# EAGLE design busfahrer (EAGLE 6.1)
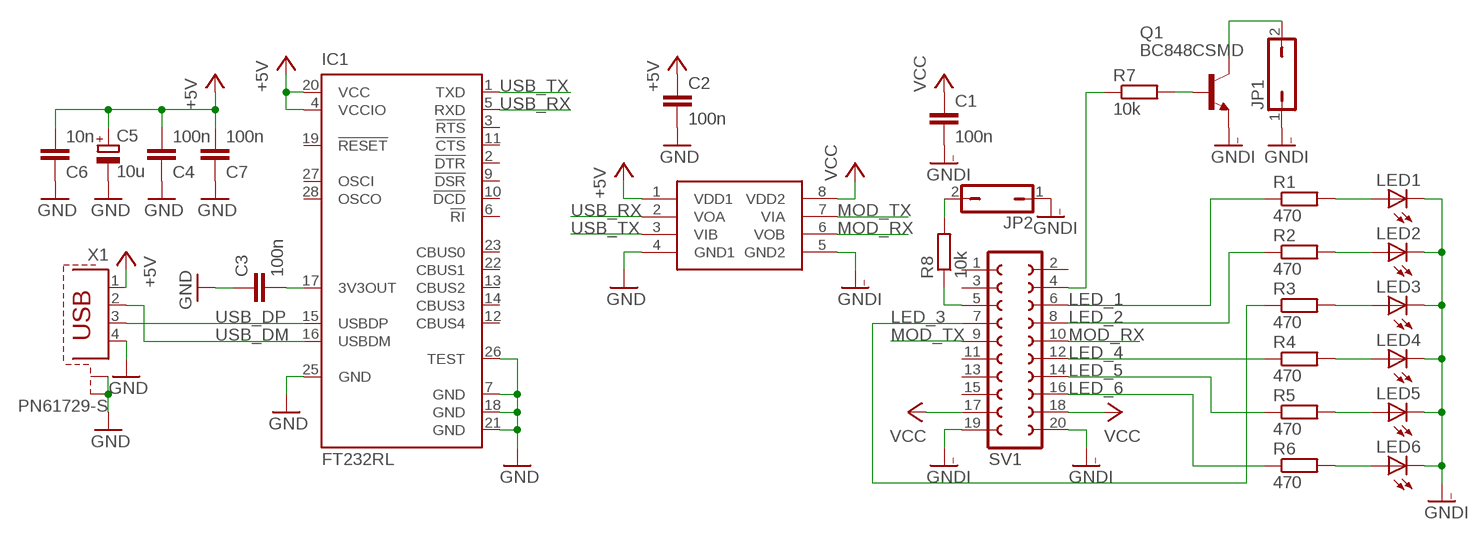
[diagram p0: schematic, sheet 1]

## Parts
C1  100n  C-EUC0805  [C0805]
C2  100n  C-EUC0805  [C0805]
C3  100n  C-EUC0805  [C0805]
C4  100n  C-EUC0805  [C0805]
C5  10u  CPOL-EUE1.8-4  [E1,8-4]
C6  10n  C-EUC0805  [C0805]
C7  100n  C-EUC0805  [C0805]
IC1  FT232RL  [SSOP28]
JP1  JP1Q  [JP1]
JP2  JP1Q  [JP1]
LED1  LEDCHIPLED_0805  [CHIPLED_0805]
LED2  LEDCHIPLED_0805  [CHIPLED_0805]
LED3  LEDCHIPLED_0805  [CHIPLED_0805]
LED4  LEDCHIPLED_0805  [CHIPLED_0805]
LED5  LEDCHIPLED_0805  [CHIPLED_0805]
LED6  LEDCHIPLED_0805  [CHIPLED_0805]
Q1  BC848CSMD  [SOT23]
R1  470  R-EU_R0805  [R0805]
R2  470  R-EU_R0805  [R0805]
R3  470  R-EU_R0805  [R0805]
R4  470  R-EU_R0805  [R0805]
R5  470  R-EU_R0805  [R0805]
R6  470  R-EU_R0805  [R0805]
R7  10k  R-EU_R0805  [R0805]
R8  10k  R-EU_R0805  [R0805]
SV1  FE10-2  [FE10-2]
U$1  ADUM3211  [SO8]
X1  PN61729-S  [PN61729-S]

## Nets
3V3: C3.2 IC1.17(3V3OUT)
!PS_ON: JP1.2 Q1.3(C)
+5V: C2.1 C4.2 C5.+ C6.2 C7.2 IC1.4(VCCIO) IC1.20(VCC) U$1.1(VDD1) X1.1
GND: C2.2 C3.1 C4.1 C5.- C6.1 C7.1 IC1.7(GND) IC1.18(GND) IC1.21(GND) IC1.25(GND) IC1.26(TEST) U$1.4(GND1) X1.4 X1.S1 X1.S2
GNDI: C1.2 JP1.1 JP2.1 LED1.C LED2.C LED3.C LED4.C LED5.C LED6.C Q1.2(E) SV1.19 SV1.20 U$1.5(GND2)
LED_1: R1.1 SV1.6
LED_2: R2.1 SV1.8
LED_3: R3.1 SV1.7
LED_4: R4.1 SV1.12
LED_5: R5.1 SV1.14
LED_6: R6.1 SV1.16
MOD_RX: SV1.10 U$1.6(VOB)
MOD_TX: SV1.9 U$1.7(VIA)
N$1: Q1.1(B) R7.2
N$2: R7.1 SV1.4
N$4: R8.1 SV1.5
N$7: LED1.A R1.2
N$8: LED2.A R2.2
N$9: LED3.A R3.2
N$10: LED4.A R4.2
N$11: LED5.A R5.2
N$12: LED6.A R6.2
PWR_OK: JP2.2 R8.2
USB_DM: IC1.16(USBDM) X1.2
USB_DP: IC1.15(USBDP) X1.3
USB_RX: IC1.5(RXD) U$1.2(VOA)
USB_TX: IC1.1(TXD) U$1.3(VIB)
VCC: C1.1 SV1.17 SV1.18 U$1.8(VDD2)
Unconnected: IC1.2(!DTR) IC1.3(!RTS) IC1.6(!RI) IC1.9(!DSR) IC1.10(!DCD) IC1.11(!CTS) IC1.12(CBUS4) IC1.13(CBUS2) IC1.14(CBUS3) IC1.19(!RESET) IC1.22(CBUS1) IC1.23(CBUS0) IC1.27(OSCI) IC1.28(OSCO) SV1.1 SV1.2 SV1.3 SV1.11 SV1.13 SV1.15

## Library data of the parts
C1-C4 C6 C7 = rcl:C-EU: CAPACITOR, European symbol
C5 = rcl:CPOL-EU: POLARIZED CAPACITOR, European symbol
IC1 = ftdichip:FT232R: Source: http://www.ftdichip.com/Documents/DataSheets/DS_FT232R_v104.pdf; MPN: FT232RL; OC_FARNELL: 1146032; OC_NEWARK: 91K9918
JP1 JP2 = jumper:JP1Q: JUMPER
LED1-LED6 = led:LED: LED OSRAM: - CHIPLED LG R971, LG N971, LY N971, LG Q971, LY Q971, LO R971, LY R971 LH N974, LH R974 LS Q976, LO Q976, LY Q976 LO Q996 - Hyper CHIPLED LW Q18S LB Q993, LB Q99A, LB R99A - SideLED LS A670, LO A670, LY A670, LG A670, LP A670 LB A673, LV A673, LT A673, LW A673 LH A674 LY A675 LS A676, LA A676, LO A676, LY A676, LW A676 LS A679, LY A679, LG A679 - Hyper Micro SIDELED® LS Y876, LA Y876, LO Y876, LY Y876 LT Y87S - SmartLED LW L88C, LW L88S LB L89C, LB L89S, LG L890 LS L89K, LO L89K, LY L89K LS L896, LA L896, LO L896, LY L896 - TOPLED LS T670, LO T670, LY T670, LG T670, LP T670 LSG T670, LSP T670, LSY T670, LOP T670, LYG T670 LG T671, LOG T671, LSG T671 LB T673, LV T673, LT T673, LW T673 LH T674 LS T676, LA T676, LO T676, LY T676, LB T676, LH T676, LSB T676, LW T676 LB T67C, LV T67C, LT T67C, LS T67K, LO T67K, LY T67K, LW E67C LS E67B, LA E67B, LO E67B, LY E67B, LB E67C, LV E67C, LT E67C LW T67C LS T679, LY T679, LG T679 LS T770, LO T770, LY T770, LG T770, LP T770 LB T773, LV T773, LT T773, LW T773 LH T774 LS E675, LA E675, LY E675, LS T675 LS T776, LA T776, LO T776, LY T776, LB T776 LHGB T686 LT T68C, LB T68C - Hyper Mini TOPLED® LB M676 - Mini TOPLED Santana® LG M470 LS M47K, LO M47K, LY M47K Source: http://www.osram.convergy.de LUXEON: - LUMILED® LXK2-PW12-R00, LXK2-PW12-S00, LXK2-PW14-U00, LXK2-PW14-V00 LXK2-PM12-R00, LXK2-PM12-S00, LXK2-PM14-U00 LXK2-PE12-Q00, LXK2-PE12-R00, LXK2-PE12-S00, LXK2-PE14-T00, LXK2-PE14-U00 LXK2-PB12-K00, LXK2-PB12-L00, LXK2-PB12-M00, LXK2-PB14-N00, LXK2-PB14-P00, LXK2-PB14-Q00 LXK2-PR12-L00, LXK2-PR12-M00, LXK2-PR14-Q00, LXK2-PR14-R00 LXK2-PD12-Q00, LXK2-PD12-R00, LXK2-PD12-S00 LXK2-PH12-R00, LXK2-PH12-S00 LXK2-PL12-P00, LXK2-PL12-Q00, LXK2-PL12-R00 Source: www.luxeon.com KINGBRIGHT: KA-3528ASYC Source: www.kingbright.com
Q1 = transistor-npn:BC848*: NPN Transistor
R1-R8 = rcl:R-EU_: RESISTOR, European symbol
SV1 = con-lsta:FE10-2: FEMALE HEADER; OC_FARNELL: unknown; OC_NEWARK: unknown
U$1 = adum3211:ADUM3211
X1 = con-berg:PN61729-S: BERG USB connector; OC_FARNELL: unknown; OC_NEWARK: unknown

## Board
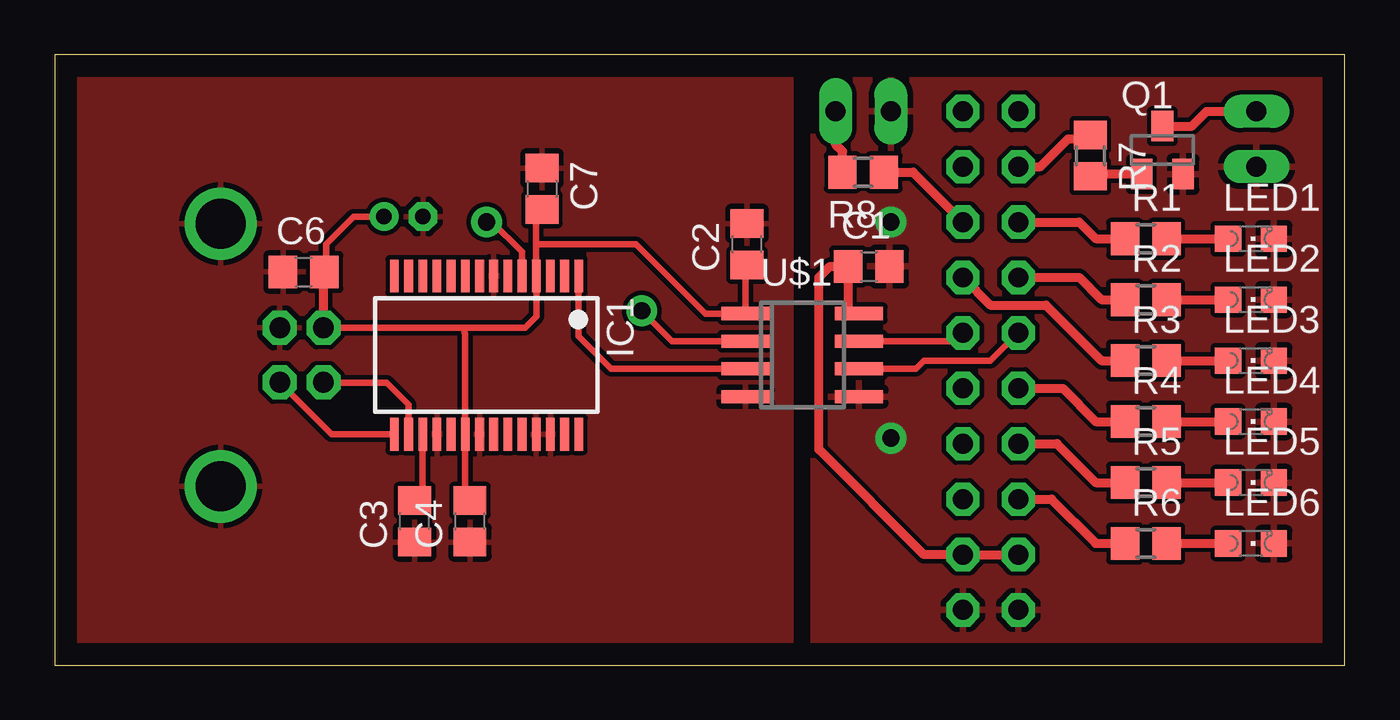
[diagram p1: board, top side]
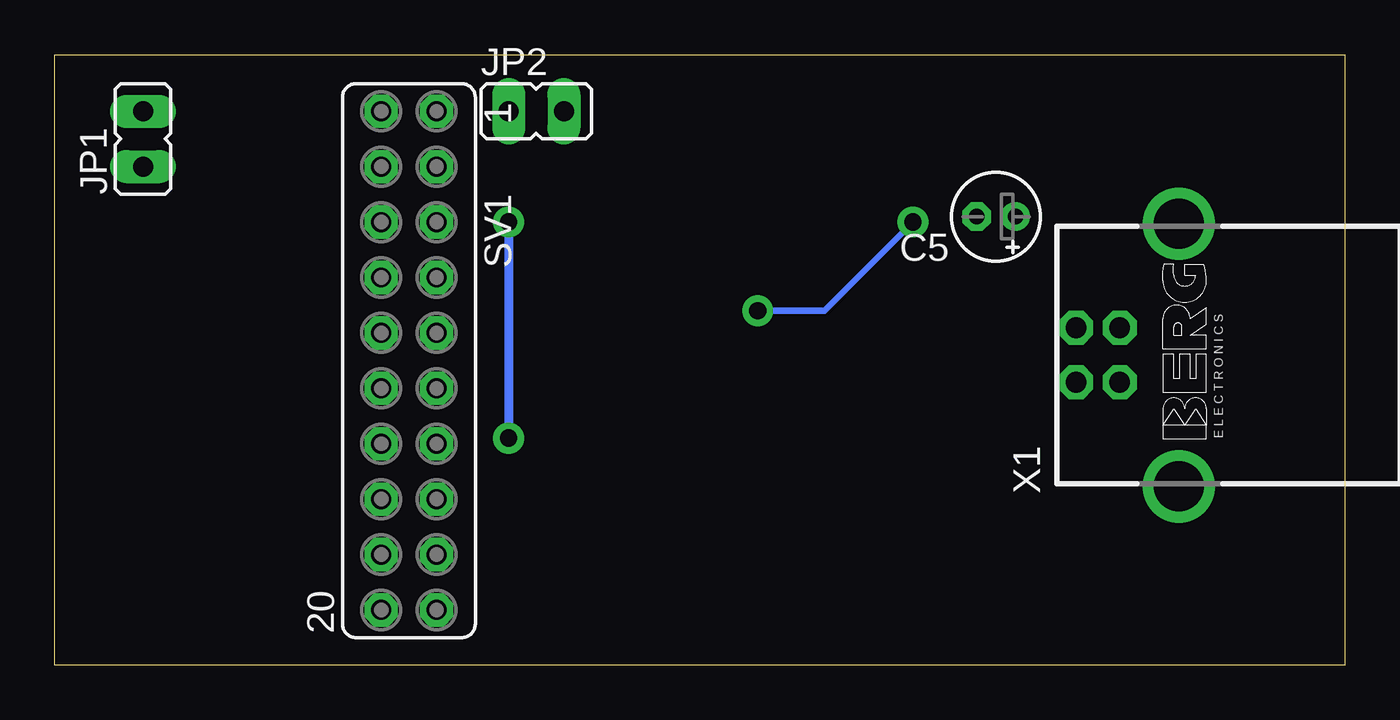
[diagram p2: board, bottom side, seen from below]

Size 59.18 x 28 mm. Coordinates in mm from the lower left corner, seen from the top.
Outline: 0,0 59.18,0 59.18,28 0,28 0,0
Copper layers (1*16): Top 0.035mm / dielectric 1.5mm / Bottom 0.035mm
Design rules: minimum track width 10mil, minimum drill 24mil, track to track 8mil, track to pad 8mil, pad to pad 8mil, via to via 8mil, smd to smd 8mil, copper to edge 40mil, drill to drill 8mil, minimum pad ring 12mil, minimum via ring 12mil, stop-mask expansion 4mil, vias tented up to drill 0mil, thermal gap 10mil

### Footprints (pad centres in the part's own frame; a part is rotated, then mirrored left to right if it is on the bottom)
C0805 = smd 1.3 x 1.5: 1 -0.95,0; 2 0.95,0
E1,8-4 = drill 0.711 pad 1.168: + -0.889,0 | drill 0.711 pad 1.168 octagon: - 0.889,0
SSOP28 = smd 0.4 x 1.5: 1 -4.225,-3.625; 2 -3.575,-3.625; 3 -2.925,-3.625; 4 -2.275,-3.625; 5 -1.625,-3.625; 6 -0.975,-3.625; 7 -0.325,-3.625; 8 0.325,-3.625; 9 0.975,-3.625; 10 1.625,-3.625; 11 2.275,-3.625; 12 2.925,-3.625; 13 3.575,-3.625; 14 4.225,-3.625; 15 4.225,3.625; 16 3.575,3.625; 17 2.925,3.625; 18 2.275,3.625; 19 1.625,3.625; 20 0.975,3.625; 21 0.325,3.625; 22 -0.325,3.625; 23 -0.975,3.625; 24 -1.625,3.625; 25 -2.275,3.625; 26 -2.925,3.625; 27 -3.575,3.625; 28 -4.225,3.625
JP1 = drill 0.914 long: 1 0,-1.27; 2 0,1.27
CHIPLED_0805 = smd 1.2 x 1.2: A 0,-1.05; C 0,1.05
SOT23 = smd 1 x 1.4: 1 -0.95,-1.1; 2 0.95,-1.1; 3 0,1.1
R0805 = smd 1.3 x 1.5: 1 -0.95,0; 2 0.95,0
FE10-2 = drill 0.914 octagon: 1 -11.43,1.27; 2 -11.43,-1.27; 3 -8.89,1.27; 4 -8.89,-1.27; 5 -6.35,1.27; 6 -6.35,-1.27; 7 -3.81,1.27; 8 -3.81,-1.27; 9 -1.27,1.27; 10 -1.27,-1.27; 11 1.27,1.27; 12 1.27,-1.27; 13 3.81,1.27; 14 3.81,-1.27; 15 6.35,1.27; 16 6.35,-1.27; 17 8.89,1.27; 18 8.89,-1.27; 19 11.43,1.27; 20 11.43,-1.27
SO8 = smd 0.6 x 2.2: 1 -1.905,-2.6; 2 -0.635,-2.6; 3 0.635,-2.6; 4 1.905,-2.6; 5 1.905,2.6; 6 0.635,2.6; 7 -0.635,2.6; 8 -1.905,2.6
PN61729-S = drill 0.95 octagon: 1 1.25,4.71; 2 -1.25,4.71; 3 -1.25,2.71; 4 1.25,2.71 | drill 2.3 pad 2.9: S1 -6.02,0; S2 6.02,0

### Placement (x,y rotation side)
C1  37.34,18.29 0 top
C2  31.75,19.3 90 top
C3  16.51,6.6 90 top
C4  19.05,6.6 90 top
C5  16,20.57 180 bottom
C6  11.43,18.03 0 top
C7  22.35,21.84 270 top
IC1  19.81,14.22 180 top
JP1  55.12,24.13 0 bottom
JP2  37.08,25.4 270 bottom
LED1  54.86,19.56 270 top
LED2  54.86,16.76 270 top
LED3  54.86,13.97 270 top
LED4  54.86,11.18 270 top
LED5  54.86,8.38 270 top
LED6  54.86,5.59 270 top
Q1  50.8,23.62 0 top
R1  50.04,19.56 0 top
R2  50.04,16.76 0 top
R3  50.04,13.97 0 top
R4  50.04,11.18 0 top
R5  50.04,8.38 0 top
R6  50.04,5.59 0 top
R7  47.5,23.37 270 top
R8  37.08,22.61 180 top
SV1  42.93,13.97 270 bottom
U$1  34.29,14.22 270 top
X1  7.62,14.22 90 bottom

### Tracks (layer width: path | path; a pad name or v marks a point on that pad's centre or on a via)
3V3
  Top 0.305: IC1.17 16.89,7.93 C3.2
!PS_ON
  Top 0.406: Q1.3 52.15,24.72 52.83,25.4 JP1.2
+5V
  Top 0.305: C4.2 18.84,7.77 IC1.20 18.84,15.2 18.8,15.24 18.8,15.47 | 18.8,15.47 X1.1 | 18.8,15.47 21.57,15.47 22.1,16 22.1,17.84 IC1.4 22.09,19.3 | 22.09,19.3 22.09,20.63 C7.2 | C5.+ 13.72,20.57 12.45,19.3 12.45,18.1 C6.2 | 22.09,19.3 26.67,19.3 29.84,16.13 U$1.1 31.69,18.29 C2.1
  Top 0.406: X1.1 12.33,17.98 C6.2
GND
  pour Top: -1.27,29.21 33.78,29.21 33.78,-1.27 -1.27,-1.27
GNDI  (via drill 0.8)
  Bottom 0.406: v38.35,20.32 v38.35,10.41
  pour Top: 34.8,28.7 61.21,28.7 61.21,-0.51 34.8,-0.51
LED_1
  Top 0.406: SV1.6 46.99,20.32 47.75,19.56 R1.1
LED_2
  Top 0.406: SV1.8 46.99,17.78 48.01,16.76 R2.1
LED_3
  Top 0.406: SV1.7 42.93,16.51 45.47,16.51 48.01,13.97 R3.1
LED_4
  Top 0.406: SV1.12 46.23,12.7 47.75,11.18 R4.1
LED_5
  Top 0.406: SV1.14 45.97,10.16 47.75,8.38 R5.1
LED_6
  Top 0.406: SV1.16 45.72,7.62 47.75,5.59 R6.1
MOD_RX
  Top 0.305: U$1.6 39.5,13.59 39.88,13.97 42.93,13.97 SV1.10
MOD_TX
  Top 0.305: U$1.7 41.27,14.86 SV1.9
N$1
  Top 0.406: Q1.1 47.67,22.52 47.5,22.35 R7.2
N$2
  Top 0.406: SV1.4 45.21,22.86 46.48,24.13 46.99,24.13 47.24,24.38 47.5,24.38 R7.1
N$4
  Top 0.406: R8.1 39.37,22.61 SV1.5
N$7
  Top 0.406: R1.2 LED1.A
N$8
  Top 0.406: R2.2 LED2.A
N$9
  Top 0.406: R3.2 LED3.A
N$10
  Top 0.406: R4.2 LED4.A
N$11
  Top 0.406: R5.2 LED5.A
N$12
  Top 0.406: R6.2 LED6.A
PWR_OK
  Top 0.406: R8.2 36.13,23.56 35.81,23.88 JP2.2
USB_DM
  Top 0.305: IC1.16 16.24,11.96 15.24,12.95 12.35,12.95 X1.2
USB_DP
  Top 0.305: IC1.15 12.71,10.6 X1.3
USB_RX  (via drill 0.8)
  Top 0.305: U$1.2 28.32,14.86 v26.92,16.26 | v19.81,20.32 20.07,20.32 21.44,18.95 IC1.5
  Bottom 0.305: v26.92,16.26 23.88,16.26 v19.81,20.32
USB_TX
  Top 0.305: IC1.1 24.04,15.08 25.53,13.59 U$1.3
VCC
  Top 0.406: SV1.18 SV1.17 39.88,5.08 35.05,9.91 35.05,17.78 35.56,18.29 C1.1 36.39,16.32 36.32,16.26 36.45,16.13 U$1.8